# EAGLE schematic 1A)power supply (EAGLE 9.6.2)
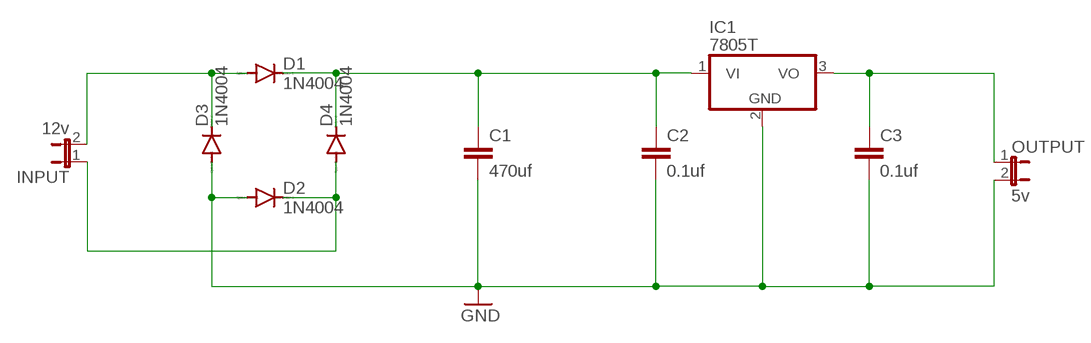
[diagram p0: schematic, sheet 1]

## Parts
C1  470uf  C2.5/2  [C2.5-2]
C2  0.1uf  C2.5/2  [C2.5-2]
C3  0.1uf  C2.5/2  [C2.5-2]
D1  1N4004  [DO41-10]
D2  1N4004  [DO41-10]
D3  1N4004  [DO41-10]
D4  1N4004  [DO41-10]
IC1  7805T  [TO220H]
INPUT  12v  JP1E  [JP1]
OUTPUT  5v  JP1E  [JP1]

## Nets
GND: C1.2 C2.2 C3.2 D2.A D3.A IC1.2(GND) OUTPUT.2
N$1: D1.A D3.C INPUT.2
N$3: D2.C D4.A INPUT.1
N$4: C1.1 C2.1 D1.C D4.C IC1.1(VI)
N$6: C3.1 IC1.3(VO) OUTPUT.1

## Library data of the parts
C1-C3 = capacitor-wima:C: CAPACITOR naming: grid - package width
D1-D4 = diode:1N4004: DIODE general purpose rectifier, 1 A
IC1 = linear:78*: Positive VOLTAGE REGULATOR Source: http://cache.national.com/ds/LM/LM78L05.pdf http://www.fairchildsemi.com/ds/LM/LM7805.pdf
INPUT OUTPUT = jumper:JP1E: JUMPER